# Altium schematic sheet ET-FLASHEEPROM.SchDoc
size A4
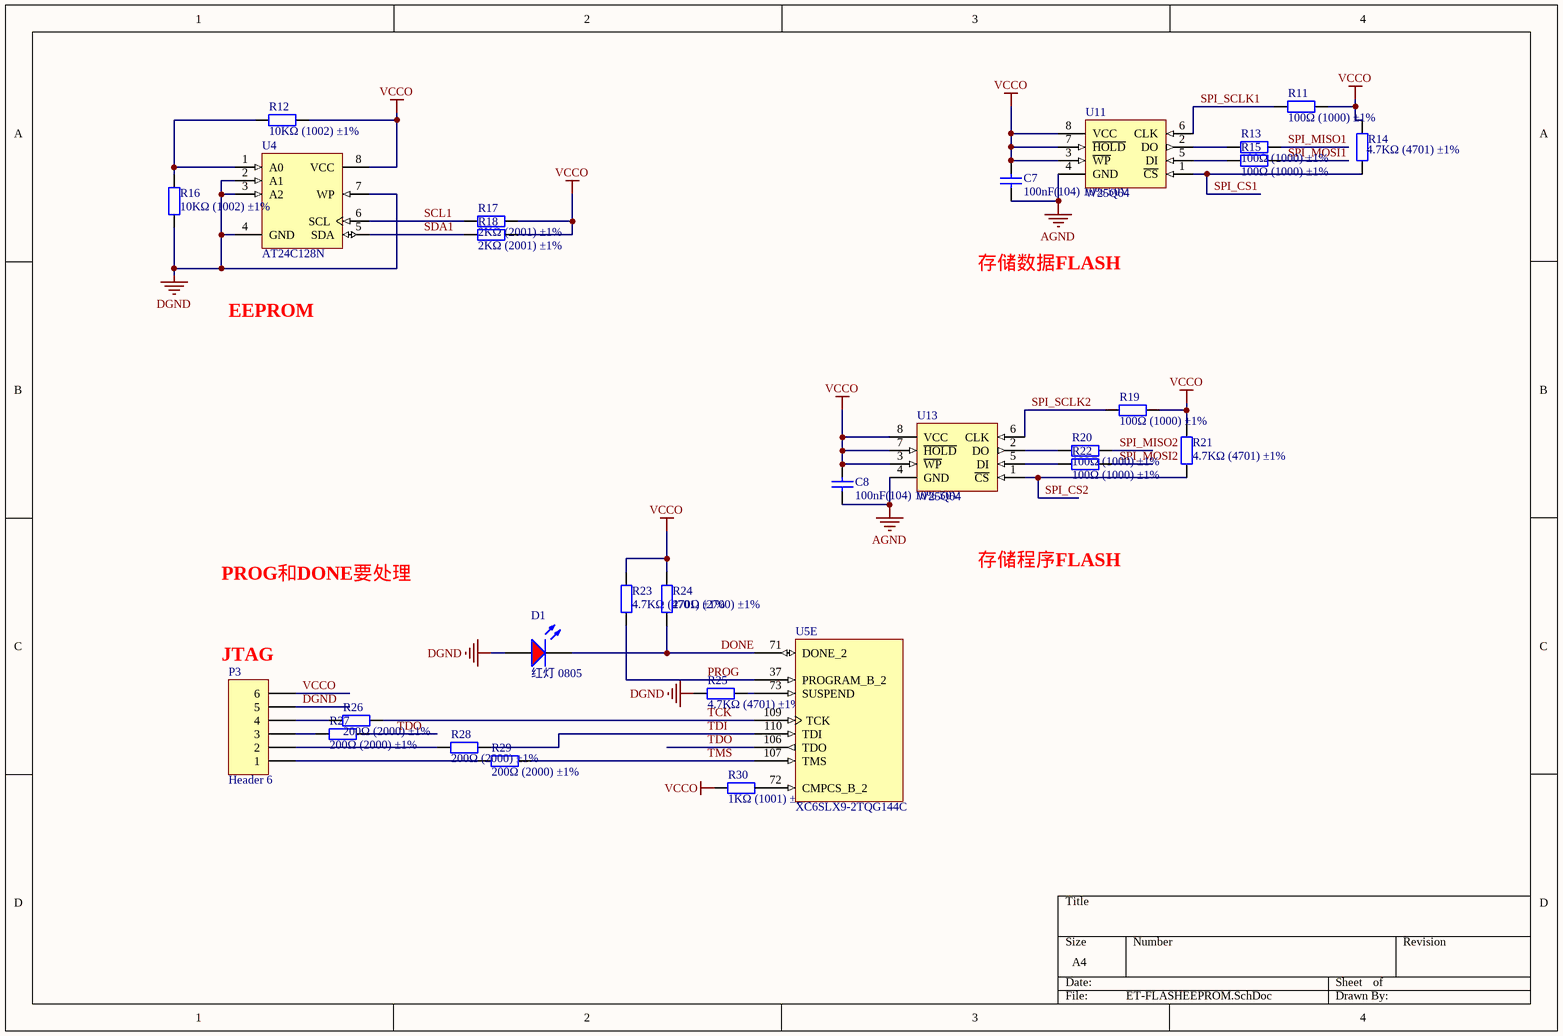
[diagram p0: ET-FLASHEEPROM.SchDoc]

## Parts
C7  100nF(104) 10% 50V  [LC-0805_C]
C8  100nF(104) 10% 50V  [LC-0805_C]
D1  红灯 0805  [LC-0805_LED_S1]
P3  Header 6  [HDR1X6]
R11  100Ω (1000) ±1%  [LC-0805_R]
R12  10KΩ (1002) ±1%  [LC-0805_R]
R13  100Ω (1000) ±1%  [LC-0805_R]
R14  4.7KΩ (4701) ±1%  [LC-0805_R]
R15  100Ω (1000) ±1%  [LC-0805_R]
R16  10KΩ (1002) ±1%  [LC-0805_R]
R17  2KΩ (2001) ±1%  [LC-0805_R]
R18  2KΩ (2001) ±1%  [LC-0805_R]
R19  100Ω (1000) ±1%  [LC-0805_R]
R20  100Ω (1000) ±1%  [LC-0805_R]
R21  4.7KΩ (4701) ±1%  [LC-0805_R]
R22  100Ω (1000) ±1%  [LC-0805_R]
R23  4.7KΩ (4701) ±1%  [LC-0805_R]
R24  270Ω (2700) ±1%  [LC-0805_R]
R25  4.7KΩ (4701) ±1%  [LC-0805_R]
R26  200Ω (2000) ±1%  [LC-0805_R]
R27  200Ω (2000) ±1%  [LC-0805_R]
R28  200Ω (2000) ±1%  [LC-0805_R]
R29  200Ω (2000) ±1%  [LC-0805_R]
R30  1KΩ (1001) ±1%  [LC-0805_R]
U4  AT24C128N  [8P3]
U5  XC6SLX9-2TQG144C  [TQG144_N]  (part E of 7)
U11  W25Q64  [LC-SOIC-8_208mil]
U13  W25Q64  [LC-SOIC-8_208mil]

## Nets
AGND: C7.1 C8.1 U11.4(GND) U13.4(GND)
DGND: D1.A P3.5 R16.1 R25.1 U4.2(A1) U4.3(A2) U4.4(GND) U4.7(WP)
VCCO: C7.2 C8.2 P3.6 R11.2 R12.2 R14.2 R17.2 R18.2 R19.2 R21.2 R23.2 R24.2 R30.1 U4.8(VCC) U11.3(~{WP}) U11.7(~{HOLD}) U11.8(VCC) U13.3(~{WP}) U13.7(~{HOLD}) U13.8(VCC)
DONE: D1.K R24.1 U5.71(DONE_2)
PROG: R23.1 U5.37(PROGRAM_B_2)
SCL1: R17.1 U4.6(SCL)
SDA1: R18.1 U4.5(SDA)
SPI_CS1: R14.1 U11.1(~{CS})
SPI_CS2: R21.1 U13.1(~{CS})
SPI_MISO1: R13.2
SPI_MISO2: R20.2
SPI_MOSI1: R15.2
SPI_MOSI2: R22.2
SPI_SCLK1: R11.1 U11.6(CLK)
SPI_SCLK2: R19.1 U13.6(CLK)
TCK: R26.2 U5.109(TCK)
TDI: R28.2 U5.110(TDI)
TDO: R27.2 U5.106(TDO)
TMS: R29.2 U5.107(TMS)
NetP3_1: P3.1 R29.1
NetP3_2: P3.2 R28.1
NetP3_3: P3.3 R27.1
NetP3_4: P3.4 R26.1
NetR12_1: R12.1 R16.2 U4.1(A0)
NetR13_1: R13.1 U11.2(DO)
NetR15_1: R15.1 U11.5(DI)
NetR20_1: R20.1 U13.2(DO)
NetR22_1: R22.1 U13.5(DI)
NetR25_2: R25.2 U5.73(SUSPEND)
NetR30_2: R30.2 U5.72(CMPCS_B_2)

## Notes on the sheet
- 存储数据FLASH
- EEPROM
- PROG和DONE要处理
- 存储程序FLASH
- (near P3) JTAG

## Library data of the parts
C7 C8 = 0805 100nF(104) 10% 50V: 贴片电容; ComponentLink1Description: 供应商链接; ComponentLink1URL: http://www.szlcsc.com/product/details_50686.html; Package: 0805; Supplier: LC; SuppliersPartNumber: C49678
D1 = 0805 红灯: 发光二极管; ComponentLink1Description: 供应商链接; ComponentLink1URL: http://www.szlcsc.com/product/details_2668.html; Package: 0805; Supplier: LC; SuppliersPartNumber: C2295
P3 = Header 6: Header, 6-Pin; LatestRevisionDate: 17-Jul-2002; LatestRevisionNote: Re-released for DXP Platform.; Publisher: Altium Limited
R11 R13 R15 R19 R20 R22 = 0805 100Ω (1000) 1%: 贴片电阻; ComponentLink1Description: 供应商链接; ComponentLink1URL: http://www.szlcsc.com/product/details_18096.html; Package: 0805; Supplier: LC; SuppliersPartNumber: C17408
R12 R16 = 0805 10KΩ (1002) 1%: 贴片电阻; ComponentLink1Description: 供应商链接; ComponentLink1URL: http://www.szlcsc.com/product/details_18102.html; Package: 0805; Supplier: LC; SuppliersPartNumber: C17414
R14 R21 R23 R25 = 0805 4.7KΩ (4701) 1%: 贴片电阻; ComponentLink1Description: 供应商链接; ComponentLink1URL: http://www.szlcsc.com/product/details_18361.html; Package: 0805; Supplier: LC; SuppliersPartNumber: C17673
R17 R18 = 0805 2KΩ (2001) 1%: 贴片电阻; ComponentLink1Description: 供应商链接; ComponentLink1URL: http://www.szlcsc.com/product/details_18292.html; Package: 0805; Supplier: LC; SuppliersPartNumber: C17604
R24 = 0805 270Ω (2700) 1%: 贴片电阻; ComponentLink1Description: 供应商链接; ComponentLink1URL: http://www.szlcsc.com/product/details_18278.html; Package: 0805; Supplier: LC; SuppliersPartNumber: C17590
R26-R29 = 0805 200Ω (2000) 1%: 贴片电阻; ComponentLink1Description: 供应商链接; ComponentLink1URL: http://www.szlcsc.com/product/details_18228.html; Package: 0805; Supplier: LC; SuppliersPartNumber: C17540
R30 = 0805 1KΩ (1001) 1%: 贴片电阻; ComponentLink1Description: 供应商链接; ComponentLink1URL: http://www.szlcsc.com/product/details_18201.html; Package: 0805; Supplier: LC; SuppliersPartNumber: C17513
U4 = AT24C01BN-SP25-B: 1Kbit (128 x 8), 2-wire Bus Automotive Serial EEPROM with Write Protect, 2.5V, 8-Pin SOIC, Bulk; Published: 20-Sep-2010; DatasheetVersion: 8517C,  Jan-2009; PackageVersion: revC, Mar-2005; PackageReference: 8S1; Publisher: Altium Limited; PackageDescription: 8-Lead (0.150" Wide Body), Plastic Gull Wing Small Outline (JEDEC SOIC); Code_JEDEC: MS-012-AA; Code_IPC: SOIC127P600-8; ComponentLink1Description: Manufacturer Link; ComponentLink1URL: http://www.atmel.com/products/serial/default.asp; ComponentLink2Description: Datasheet; ComponentLink2URL: http://www.atmel.com/dyn/resources/prod_documents/doc8517.pdf; ComponentLink3Description: Atmel.com Home; ComponentLink3URL: http://www.atmel.com
U5 = XC6SLX9-2TQG144C: Spartan-6 LX 1.2V FPGA, 102 User I/Os, 144-Pin TQFP (0.5mm Pitch), Speed Grade 2, Commercial Grade, Pb-Free; Published: 17-Nov-2009; DatasheetVersion: ver1.6, Nov-2010; PackageVersion: ver1.2, Jun-2004; PackageReference: TQG144; Publisher: Altium Limited; PackageDescription: 144-Pin Thin Quad Flat Pack (TQG144) - Pb-Free; Supplier 1: Digi-Key; Supplier Part Number 1: XC6SLX9-2TQG144C-ND; Code_JEDEC: MS-026-BFB; ComponentLink1Description: Manufacturer Link; ComponentLink1URL: http://www.xilinx.com; ComponentLink2Description: Spartan-6 Datasheet; ComponentLink2URL: http://www.xilinx.com/support/documentation/data_sheets/ds160.pdf; ComponentLink3Description: Spartan-6 Documents; ComponentLink3URL: http://www.xilinx.com/support/documentation/spartan-6.htm; ComponentLink4Description: Xilinx.com Home; ComponentLink4URL: http://www.xilinx.com